# Altium project linkit-v4-hw.PrjPcb (part 2 of 2)

## Sheet interface.SchDoc
size A4; Organization: Arribada Initiative; Address1: https://github.com/arribada; Address2: contact@arribada.org; Address3: arribada.org; Address4: UK - Portsmouth; DocumentNumber: 10; SheetNumber: 10; SheetTotal: 13
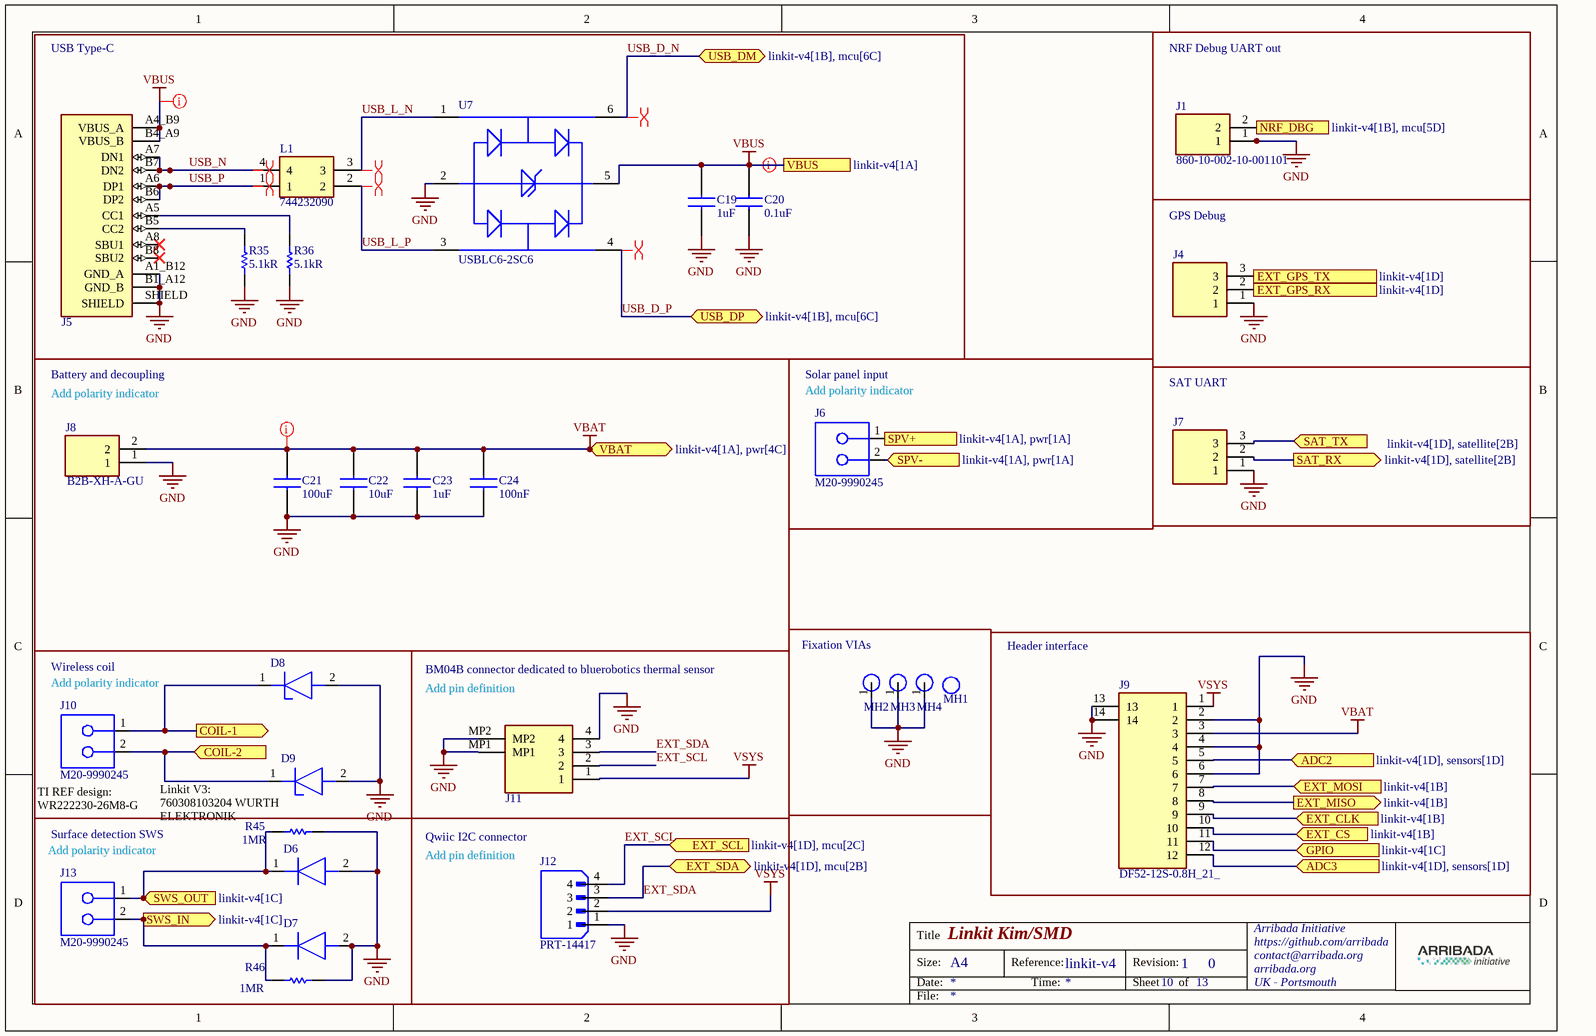
[diagram p4: interface.SchDoc]

### Parts
C19  1uF  [CAPC0603X35N]
C20  value 0.1uF  [CAPC0603X33N]  (hidden comment: 100nF)
C21  value 100uF  [CAPC3216X180N]  (hidden comment: GRM31CR61A107MEA8L)
C22  value 10uF  [CAPC1005X55N]  (hidden comment: GRM155R61A106ME11D)
C23  value 1uF  [CAPC1005X55N]  (hidden comment: GRM155R61E105KE11D)
C24  value 100nF  [0402]  (hidden comment: GRM155R71C104KA88D)
D6  ESD9L5.0ST5GH  [SODFL1006X40N]  (value not drawn)
D7  ESD9L5.0ST5GH  [SODFL1006X40N]  (value not drawn)
D8  PESD12VS1UL,315  [PESD5V0S1BL315]  (value not drawn)
D9  PESD12VS1UL,315  [PESD5V0S1BL315]  (value not drawn)
J1  860-10-002-10-001101  [8601000210001101]
J4  BC020-03-A-0200-0300-L-G  [BC02003A02000300LG]  (value not drawn)
J5  USB4215-03-A_REVA  [GCT_USB4215-03-A_REVA]  (value not drawn)
J6  M20-9990245  [HDR 2POS 2.54MM THRU HOLE]
J7  BC020-03-A-0200-0300-L-G  [BC02003A02000300LG]  (value not drawn)
J8  B2B-XH-A-GU  [B2BXHAGU]
J9  DF52-12S-0.8H_21_  [DF5212S08H21]
J10  M20-9990245  [HDR 2POS 2.54MM THRU HOLE]
J11  BM04B-GHS-TBT_LF__SN__N_  [CONN_BM04B-GHS-TBT_JST]  (value not drawn)
J12  PRT-14417  [SPARKFUN_PRT-14417]
J13  M20-9990245  [HDR 2POS 2.54MM THRU HOLE]
L1  744232090  [WE-CNSW-SMD]
MH1  Mounting Hole M2  [MOUNTING HOLE M2 UNPLATED]  (value not drawn)
MH2  Mounting Hole M2 Plated  [Mounting Hole M2 Plated]  (value not drawn)
MH3  Mounting Hole M2 Plated  [Mounting Hole M2 Plated]  (value not drawn)
MH4  Mounting Hole M2 Plated  [Mounting Hole M2 Plated]  (value not drawn)
R35  value 5.1kR  [RESC0603X28N]  (hidden comment: CRCW02015K10JNED)
R36  value 5.1kR  [RESC0603X28N]  (hidden comment: CRCW02015K10JNED)
R45  value 1MR  [RESC0603X26N]  (hidden comment: RC0201FR-7D1ML)
R46  value 1MR  [RESC0603X26N]  (hidden comment: RC0201FR-7D1ML)
U7  USBLC6-2SC6  [SOT95P280X145-6N]

### Blocks framed on the sheet
NRF Debug UART out: J1
USB Type-C: C19 C20 J5 L1 R35 R36 U7
GPS Debug: J4
SAT UART: J7
Fixation VIAs: MH1-MH4
Header interface: J9

### Ports
ADC2 (in, see linkit-v4[1D], sensors[1D]), ADC3 (in, see linkit-v4[1D], sensors[1D]), COIL-1 (out, see linkit-v4[1A], BQ51003YFPT_WirelessCharger_2.5W[1B], pwr[1C]), COIL-2 (in, see linkit-v4[1A], BQ51003YFPT_WirelessCharger_2.5W[1C], pwr[1C]), EXT_CLK (in, see linkit-v4[1B]), EXT_CS (in, see linkit-v4[1B]), EXT_GPS_RX (in, see linkit-v4[1D]), EXT_GPS_TX (in, see linkit-v4[1D]), EXT_MISO (out, see linkit-v4[1B]), EXT_MOSI (in, see linkit-v4[1B]), EXT_SCL (in, see linkit-v4[1D], mcu[2C]), EXT_SDA (bidir, see linkit-v4[1D], mcu[2B]), GPIO (in, see linkit-v4[1C]), NRF_DBG (in, see linkit-v4[1B], mcu[5D]), SAT_RX (out, see linkit-v4[1D], satellite[2B]), SAT_TX (in, see linkit-v4[1D], satellite[2B]), SPV+ (out, see linkit-v4[1A], pwr[1A]), SPV- (in, see linkit-v4[1A], pwr[1A]), SWS_IN (out, see linkit-v4[1C]), SWS_OUT (in, see linkit-v4[1C]), USB_DM (bidir, see linkit-v4[1B], mcu[6C]), USB_DP (bidir, see linkit-v4[1B], mcu[6C]), VBAT (bidir, see linkit-v4[1A], pwr[4C]), VBUS (see linkit-v4[1A])

### Nets
GND: C19.1 C20.1 C21.1 C22.2 C23.2 C24.2 D6.2(A) D7.2(A) D8.2(A) D9.2(A) J1.1 J4.1 J5.A1_B12(GND_A) J5.B1_A12(GND_B) J5.SHIELD J7.1 J8.1 J9.2 J9.4 J9.6 J9.13 J9.14 J11.4 J11.MP1 J11.MP2 J12.1 MH2.1 MH3.1 MH4.1 R35.1 R36.1 R45.2 R46.2 U7.2(GND)
VBAT: C21.2 C22.1 C23.1 C24.1 J8.2 J9.3 ; port VBAT
VBUS: C19.2 C20.2 J5.A4_B9(VBUS_A) J5.B4_A9(VBUS_B) U7.5(VBUS) ; port VBUS
VSYS: J9.1 J11.1 J12.2
ADC2: J9.5 ; port ADC2
ADC3: J9.12 ; port ADC3
COIL-1: D8.1(K) J10.1 ; port COIL-1
COIL-2: D9.1(K) J10.2 ; port COIL-2
EXT_CLK: J9.9 ; port EXT_CLK
EXT_CS: J9.10 ; port EXT_CS
EXT_GPS_RX: J4.2 ; port EXT_GPS_RX
EXT_GPS_TX: J4.3 ; port EXT_GPS_TX
EXT_MISO: J9.8 ; port EXT_MISO
EXT_MOSI: J9.7 ; port EXT_MOSI
EXT_SCL: J11.2 J12.4 ; port EXT_SCL
EXT_SDA: J11.3 J12.3 ; port EXT_SDA
GPIO: J9.11 ; port GPIO
NRF_DBG: J1.2 ; port NRF_DBG
SAT_RX: J7.2 ; port SAT_RX
SAT_TX: J7.3 ; port SAT_TX
SPV+: J6.1 ; port SPV+
SPV-: J6.2 ; port SPV-
SWS_IN: D7.1(K) J13.2 R46.1 ; port SWS_IN
SWS_OUT: D6.1(K) J13.1 R45.1 ; port SWS_OUT
USB_D_N: U7.6(I/O1_2) ; port USB_DM
USB_D_P: U7.4(I/O2_2) ; port USB_DP
USB_L_N: L1.3 U7.1(I/O1_1)
USB_L_P: L1.2 U7.3(I/O2_1)
USB_N: J5.A7(DN1) J5.B7(DN2) L1.4
USB_P: J5.A6(DP1) J5.B6(DP2) L1.1
NetJ5_A5: J5.A5(CC1) R36.2
NetJ5_B5: J5.B5(CC2) R35.2

Not connected (* = marked no-connect by the designer): J5 A8(SBU1)* B8(SBU2)*

### Layout directives
differential pair; rule Impedance Constraint [Min = 80.00    Max = 100.0    ]; differential pair class USB: USB_D_N, USB_D_P, USB_L_N, USB_L_P, USB_N, USB_P
net class Power; rule Width Constraint [Pref Width = 0.4mm    Min Width = 0.2mm    Max Width = 0.8mm]; rule Width Constraint [Pref Width = 0.4mm    Min Width = 0.2mm    Max Width = 0.8mm]; rule Width Constraint [Pref Width = 0.4mm    Min Width = 0.2mm    Max Width = 0.8mm]; rule Width Constraint [Pref Width = 0.4mm    Min Width = 0.2mm    Max Width = 0.8mm]: VBAT, VBUS

### Notes on the sheet
- Battery and decoupling
- Solar panel input
- (near J8) Add polarity indicator
- (near J6) Add polarity indicator
- (near J10) Add polarity indicator
- Wireless coil
- BM04B connector dedicated to bluerobotics thermal sensor
- (near J11) Add pin definition
- (near J10) TI REF design:
  WR222230-26M8-G
- (near J13) Add polarity indicator
- Surface detection SWS
- Linkit V3:
  760308103204 WURTH ELEKTRONIK
- Qwiic I2C connector
- Add pin definition
- Title
- Size:
- Date:
- A4
- Reference:
- Time:
- Revision:
- Sheet
- of
- File:

### Library data of the parts
C19 = CL03A105KP3NSNC: Multilayer Ceramic Capacitors MLCC - SMD/SMT 1uF+/-10% 10V X5R 06 0201; Manufacturer_Name: SAMSUNG; Geometry.Height: 0.35mm; Mouser Part Number: 187-CL03A105KP3NSNC; Mouser Price/Stock: https://www.mouser.co.uk/ProductDetail/Samsung-Electro-Mechanics/CL03A105KP3NSNC?qs=47mY1nHWefQ3GOjXGTFrfg%3D%3D; Manufacturer_Part_Number: CL03A105KP3NSNC; Datasheet Link: https://datasheet.datasheetarchive.com/originals/distributors/DKDS-19/372696.pdf; Value: 1uF
C20 = GRM033Z71C104KE14D: Multilayer Ceramic Capacitors MLCC - SMD/SMT .1UF     16V   10%        0201; Manufacturer_Name: Murata Electronics; Manufacturer 1: Murata; Geometry.Height: 0.33mm; Description 1: Cap Ceramic 0.1uF 16V X7R 10% Pad SMD 0201 125C T/R; Mouser Part Number: 81-GRM033Z71C104KE4D; Mouser Price/Stock: https://www.mouser.co.uk/ProductDetail/Murata-Electronics/GRM033Z71C104KE14D?qs=lEfY3O89AqkdMqrSfAAk2w%3D%3D; Manufacturer_Part_Number: GRM033Z71C104KE14D; Datasheet Link: http://www.murata.com/~/media/webrenewal/support/library/catalog/products/capacitor/mlcc/c02e.pdf; Supplier 1: Mouser; Supplier Part Number 1: 81-GRM033Z71C104KE4D; Manufacturer Part Number 1: GRM033Z71C104KE14D; RoHS 1: Yes; Category 1: Ceramic Capacitors; Stock 1: 739403; Pricing 1: 1=0,1, 10=0,017, 50=0,017, 100=0,01, 1000=0,008, 10000=0,006 (USD); Case/Package: 0201; RoHS Compliant: Yes
C21 = GRM31CR61A107MEA8L: Multilayer Ceramic Capacitors MLCC - SMD/SMT 100 uF 10 VDC 20% 1206 X5R; Manufacturer_Name: Murata Electronics; Datasheet Link: http://www.murata.com/~/media/webrenewal/support/library/catalog/products/capacitor/mlcc/c02e.pdf; Height: 1.8mm; Manufacturer_Part_Number: GRM31CR61A107MEA8L; Mouser Part Number: 81-GRM31CR61A107MA8L; Mouser Price/Stock: https://www.mouser.co.uk/ProductDetail/Murata-Electronics/GRM31CR61A107MEA8L?qs=hd1VzrDQEGidurXiDTJOCg%3D%3D; Arrow Part Number: GRM31CR61A107MEA8L; Arrow Price/Stock: https://www.arrow.com/en/products/grm31cr61a107mea8l/murata-manufacturing?region=nac
C22 = GRM155R61A106ME11D: Multilayer Ceramic Capacitors MLCC - SMD/SMT 10 uF 10 VDC 20% 0402 X5R; Manufacturer_Name: Murata Electronics; Datasheet Link: http://www.murata.com/~/media/webrenewal/support/library/catalog/products/capacitor/mlcc/c02e.pdf; Height: 0.55mm; Manufacturer_Part_Number: GRM155R61A106ME11D; Mouser Part Number: 81-GRM155R61A106ME1D; Mouser Price/Stock: https://www.mouser.co.uk/ProductDetail/Murata-Electronics/GRM155R61A106ME11D?qs=xZ%2FP%252Ba9zWqZMJSi57Q8OyA%3D%3D; Arrow Part Number: GRM155R61A106ME11D; Arrow Price/Stock: https://www.arrow.com/en/products/grm155r61a106me11d/murata-manufacturing?region=nac
C23 = GRM155R61E105KE11D: Multilayer Ceramic Capacitors MLCC - SMD/SMT 1 uF 25 VDC 10% 0402 X5R; Manufacturer_Name: Murata Electronics; Datasheet Link: http://www.murata.com/~/media/webrenewal/support/library/catalog/products/capacitor/mlcc/c02e.pdf; Height: 0.55mm; Manufacturer_Part_Number: GRM155R61E105KE11D; Mouser Part Number: 81-GRM155R61E105KE1D; Mouser Price/Stock: https://www.mouser.co.uk/ProductDetail/Murata-Electronics/GRM155R61E105KE11D?qs=QzBtWTOodeUQ00WJlpqFiw%3D%3D; Arrow Part Number: GRM155R61E105KE11D; Arrow Price/Stock: https://www.arrow.com/en/products/grm155r61e105ke11d/murata-manufacturing?region=nac
C24 = GRM155R71C104KA88D: Multilayer Ceramic Capacitors MLCC - SMD/SMT 0.1 uF 16 VDC 10% 0402 X7R; Manufacturer_Part_Number: CC0402KRX7R7BB104; Manufacturer: YAGEO; Manufacturer 1: Murata; Description 1: 0402 0.1 uF 16V ±10 % Tolerance X7R SMT Multilayer Ceramic Capacitor; Voltage Rating: 16V; Package: C0402; Supplier 1: Mouser; Supplier Part Number 1: 81-GRM155R71C104KA88; Manufacturer Part Number 1: GRM155R71C104KA88D; RoHS 1: Yes; Category 1: Ceramic Capacitors; Stock 1: 7816691; Pricing 1: 1=0,1, 10=0,017, 50=0,017, 100=0,01, 1000=0,008, 10000=0,005 (USD); Mount: Surface Mount; Case/Package: 0402; Number of Pins: 2; Case Code (Metric): 1005; Case Code (Imperial): 0402; Material: Ceramic; Dielectric Material: Ceramic; Min Operating Temperature: -55°C; Max Operating Temperature: 125°C; Capacitance: 100nF; Tolerance: 10%; Packaging: Tape and Reel; Voltage Rating (DC): 16V; Package Quantity: 1; Dielectric: X7R; Termination: SMD/SMT; Voltage: 16V; Series: GRM; Length: 1mm; Width: 0.02inch; Height: 0.5mm; Thickness: 0.022inch; Depth: 0.5mm; Radiation Hardening: No; Lead Free: Lead Free; RoHS Compliant: Yes; Reach SVHC Compliant: Unknown; ComponentLink1URL: https://datasheet.ciiva.com/129/grm155r71c104ka88-01-129739.pdf?src-supplier=Digi-Key; ComponentLink1Description: https://datasheet.ciiva.com/129/grm155r71c104ka88-01-129739.pdf?src-supplier=Digi-Key; ComponentLink2URL: https://datasheet.ciiva.com/129/grm155r71c104ka88-01-129740.pdf?src-supplier=Digi-Key; ComponentLink2Description: https://datasheet.ciiva.com/129/grm155r71c104ka88-01-129740.pdf?src-supplier=Digi-Key; ComponentLink3URL: https://datasheet.ciiva.com/29199/454098-da-01-en-vs-kondensator-0402-29199799.pdf?src-supplier=Conrad; ComponentLink3Description: https://datasheet.ciiva.com/29199/454098-da-01-en-vs-kondensator-0402-29199799.pdf?src-supplier=Conrad; ComponentLink4URL: https://datasheet.ciiva.com/7937/4360-7937615.pdf?src-supplier=Element14; ComponentLink4Description: https://datasheet.ciiva.com/7937/4360-7937615.pdf?src-supplier=Element14; ComponentLink5URL: https://datasheet.ciiva.com/14116/grmseries-highdielectrictype-eng-14116878.pdf?src-supplier=Distrelec; ComponentLink5Description: https://datasheet.ciiva.com/14116/grmseries-highdielectrictype-eng-14116878.pdf?src-supplier=Distrelec; ComponentLink6URL: https://datasheet.ciiva.com/14103/grmseries-highdielectrictype-eng-14103750.pdf?src-supplier=Distrelec; ComponentLink6Description: https://datasheet.ciiva.com/14103/grmseries-highdielectrictype-eng-14103750.pdf?src-supplier=Distrelec; ComponentLink7URL: https://datasheet.ciiva.com/28534/4360-28534127.pdf?src-supplier=Element14; ComponentLink7Description: https://datasheet.ciiva.com/28534/4360-28534127.pdf?src-supplier=Element14; ComponentLink8URL: https://datasheet.ciiva.com/28534/4360-28534133.pdf?src-supplier=Element14; ComponentLink8Description: https://datasheet.ciiva.com/28534/4360-28534133.pdf?src-supplier=Element14
D6 D7 = ESD9L5.0ST5GH: Diode; Manufacturer_Name: onsemi; Datasheet Link: https://www.onsemi.com/pdf/datasheet/esd9l-d.pdf; Height: 0.4mm; Manufacturer_Part_Number: ESD9L5.0ST5GH
D8 D9 = PESD12VS1UL,315: Diode ESD (Uni-directional); Manufacturer_Name: Nexperia; Datasheet Link: https://assets.nexperia.com/documents/data-sheet/PESD12VS1UL.pdf; Height: 0mm; Manufacturer_Part_Number: PESD12VS1UL,315; Mouser Part Number: 771-PESD12VS1UL315; Mouser Price/Stock: https://www.mouser.co.uk/ProductDetail/Nexperia/PESD12VS1UL315?qs=LOCUfHb8d9vNAqHjzC5o%2FA%3D%3D; Arrow Part Number: PESD12VS1UL,315; Arrow Price/Stock: https://www.arrow.com/en/products/pesd12vs1ul315/nexperia?utm_currency=USD&region=nac
J1 = 860-10-002-10-001101: Connector, Header 2 pos, 1 row, pitch 1mm; Manufacturer_Name: Preci-Dip; Datasheet Link: https://www.precidip.com/AppHost/9696,1/Scripts/Modules/Catalog/Default.aspx?c=8&i=516&p=101&pdf=1&dsku=860-10-NNN-10-001101; Height: 3.63mm; Manufacturer_Part_Number: 860-10-002-10-001101; Mouser Part Number: 437-8601000210001101; Mouser Price/Stock: https://www.mouser.co.uk/ProductDetail/Preci-dip/860-10-002-10-001101?qs=jrVTBkKbt4YuZ%2FSZyJlz1w%3D%3D
J4 J7 = BC020-03-A-0200-0300-L-G: Connector; Manufacturer_Name: GCT (GLOBAL CONNECTOR TECHNOLOGY); Datasheet Link: https://www.mouser.com/datasheet/2/837/BC020-1948594.pdf; Height: 3.2mm; Manufacturer_Part_Number: BC020-03-A-0200-0300-L-G
J5 = USB4215-03-A_REVA: USB Connectors USB C Receptacle, Short Body, USB2.0, 16Pin, Horizontal, SMT; MF: Global Connector Technology; SnapEDA_Link: https://www.snapeda.com/parts/USB4215-03-A/Global+Connector+Technology/view-part/?ref=snap; Package: None; Value: *; MP: USB4215-03-A; Check_prices: https://www.snapeda.com/parts/USB4215-03-A/Global+Connector+Technology/view-part/?ref=eda
J6 J10 J13 = M20-9990245: CON HDR 2POS HEADER 2.54MM VERT THRU HOLE; Manufacturer: Harwin; Manufacturers Part Number: M20-9990245; Supplier 1: Digi-Key; Supplier 2: Mouser; Supplier Part Number 1: 952-2261-ND; Supplier Part Number 2: 855-M20-9990245; Distributor 1: EBV; Distributor 2: Future Electronics
J8 = B2B-XH-A-GU: Connector; Manufacturer_Name: JST (JAPAN SOLDERLESS TERMINALS); Datasheet Link: http://www.jst-mfg.com/product/pdf/eng/eXH.pdf; Height: 7mm; Manufacturer_Part_Number: B2B-XH-A-GU; Mouser Part Number: N/A; Mouser Price/Stock: https://www.mouser.co.uk/ProductDetail/JST-Commercial/B2B-XH-A-GU?qs=IKkN%2F947nfBVsqimfO%252BieQ%3D%3D; Arrow Part Number: B2B-XH-A-GU; Arrow Price/Stock: https://www.arrow.com/en/products/b2b-xh-a-gu/jst-manufacturing?utm_currency=USD&region=europe
J9 = DF52-12S-0.8H_21_: Headers & Wire Housings Recep 12P R/A 0.8mm Pitch; Manufacturer_Name: Hirose; Manufacturer_Part_Number: DF52-12S-0.8H(21); Datasheet Link: https://www.hirose.com/product/en/products/DF52/DF52-12S-0.8H%2821%29/; Height: 1mm; Mouser Part Number: 798-DF52-12S-0.8H21; Mouser Price/Stock: https://www.mouser.co.uk/ProductDetail/Hirose-Connector/DF52-12S-0.8H21?qs=%2FKR40Cd6GUo160JXe3226w%3D%3D
J11 = BM04B-GHS-TBT_LF__SN__N_: Headers & Wire Housings GH HEADER (SMT/TOP TYPE); Manufacturer_Name: JST (JAPAN SOLDERLESS TERMINALS); Manufacturer_Part_Number: BM04B-GHS-TBT(LF)(SN)(N); Datasheet Link: http://www.jst-mfg.com/product/pdf/eng/eGH.pdf; Height: 4.05mm; Mouser Part Number: N/A; Mouser Price/Stock: https://www.mouser.co.uk/ProductDetail/JST-Commercial/BM04B-GHS-TBTLFSNN?qs=QpmGXVUTftGHKxacCgPJ1g%3D%3D; Arrow Part Number: BM04B-GHS-TBT(LF)(SN)(N); Arrow Price/Stock: https://www.arrow.com/en/products/bm04b-ghs-tbt-lf-sn-n/jst-manufacturing?region=europe
J12 = PRT-14417: QWIIC JST CONNECTOR - SMD 4-PIN; MF: SparkFun Electronics; SnapEDA_Link: https://www.snapeda.com/parts/PRT-14417/SparkFun+Electronics/view-part/?ref=snap; Package: None; Value: *; MP: PRT-14417; Check_prices: https://www.snapeda.com/parts/PRT-14417/SparkFun+Electronics/view-part/?ref=eda
L1 = 744232090: Common Mode Chokes / Filters WE-CNSW 1206 370mA 90Ohm 100MHz AECQ200; Manufacturer_Name: Wurth Elektronik; Datasheet Link: https://datasheet.datasheetarchive.com/originals/distributors/Datasheets_SAMA/c4bd373adc4470b1464be5d10e6e206e.pdf; Manufacturer_Part_Number: 744232090; Mouser Part Number: 710-744232090; Mouser Price/Stock: https://www.mouser.co.uk/ProductDetail/Wurth-Elektronik/744232090?qs=PGXP4M47uW6L5fAiLO6yTw%3D%3D
MH1 = Mounting Hole M2: Manufacturer: NOT FITTED PART; Manufacturers Part Number: NOT FITTED PART; Distributor 1: EBV; Distributor 2: Future Electronics
MH2-MH4 = Mounting Hole M2 Plated: Manufacturer: NOT FITTED PART; Manufacturers Part Number: NOT FITTED PART; Distributor 1: EBV; Distributor 2: Future Electronics
R35 R36 = CRCW02015K10JNED: Thick Film Resistors - SMD 1/20watt 5.1Kohms 5% 200ppm; Manufacturer_Name: Vishay; Datasheet Link: http://www.vishay.com/docs/20035/dcrcwe3.pdf; Height: 0.28mm; Manufacturer_Part_Number: CRCW02015K10JNED; Mouser Part Number: 71-CRCW02015K10JNED; Mouser Price/Stock: https://www.mouser.com/Search/Refine.aspx?Keyword=71-CRCW02015K10JNED
R45 R46 = RC0201FR-7D1ML: Thick Film Resistors - SMD 1 MOhms 50 mW 0201 1%; Manufacturer_Name: KEMET; Datasheet Link: http://www.yageo.com/documents/recent/PYu-RC0201_51_RoHS_L_8.pdf; Height: 0.26mm; Manufacturer_Part_Number: RC0201FR-7D1ML; Mouser Part Number: 603-RC0201FR-7D1ML; Mouser Price/Stock: https://www.mouser.co.uk/ProductDetail/YAGEO/RC0201FR-7D1ML?qs=NgbZBzc1CyEo5FlGf5N0Ug%3D%3D; Arrow Part Number: RC0201FR-7D1ML; Arrow Price/Stock: https://www.arrow.com/en/products/rc0201fr-7d1ml/yageo
U7 = USBLC6-2SC6: ESD Suppressors / TVS Diodes High Speed Interface Protection Low Cap; Manufacturer_Name: STMicroelectronics; Datasheet Link: http://www.st.com/st-web-ui/static/active/en/resource/technical/document/datasheet/CD00050750.pdf; Height: 1.45mm; Manufacturer_Part_Number: USBLC6-2SC6; Mouser Part Number: 511-USBLC6-2SC6; Mouser Price/Stock: https://www.mouser.co.uk/ProductDetail/STMicroelectronics/USBLC6-2SC6?qs=po45yt2pPpu%2FhNIlwQdTlg%3D%3D; Arrow Part Number: USBLC6-2SC6; Arrow Price/Stock: https://www.arrow.com/en/products/usblc6-2sc6/stmicroelectronics?utm_currency=USD&region=europe

## Sheet pwr.SchDoc
size A4; Organization: Arribada Initiative; Address1: https://github.com/arribada; Address2: contact@arribada.org; Address3: arribada.org; Address4: UK - Portsmouth; DocumentNumber: 3; SheetNumber: 3; SheetTotal: 13
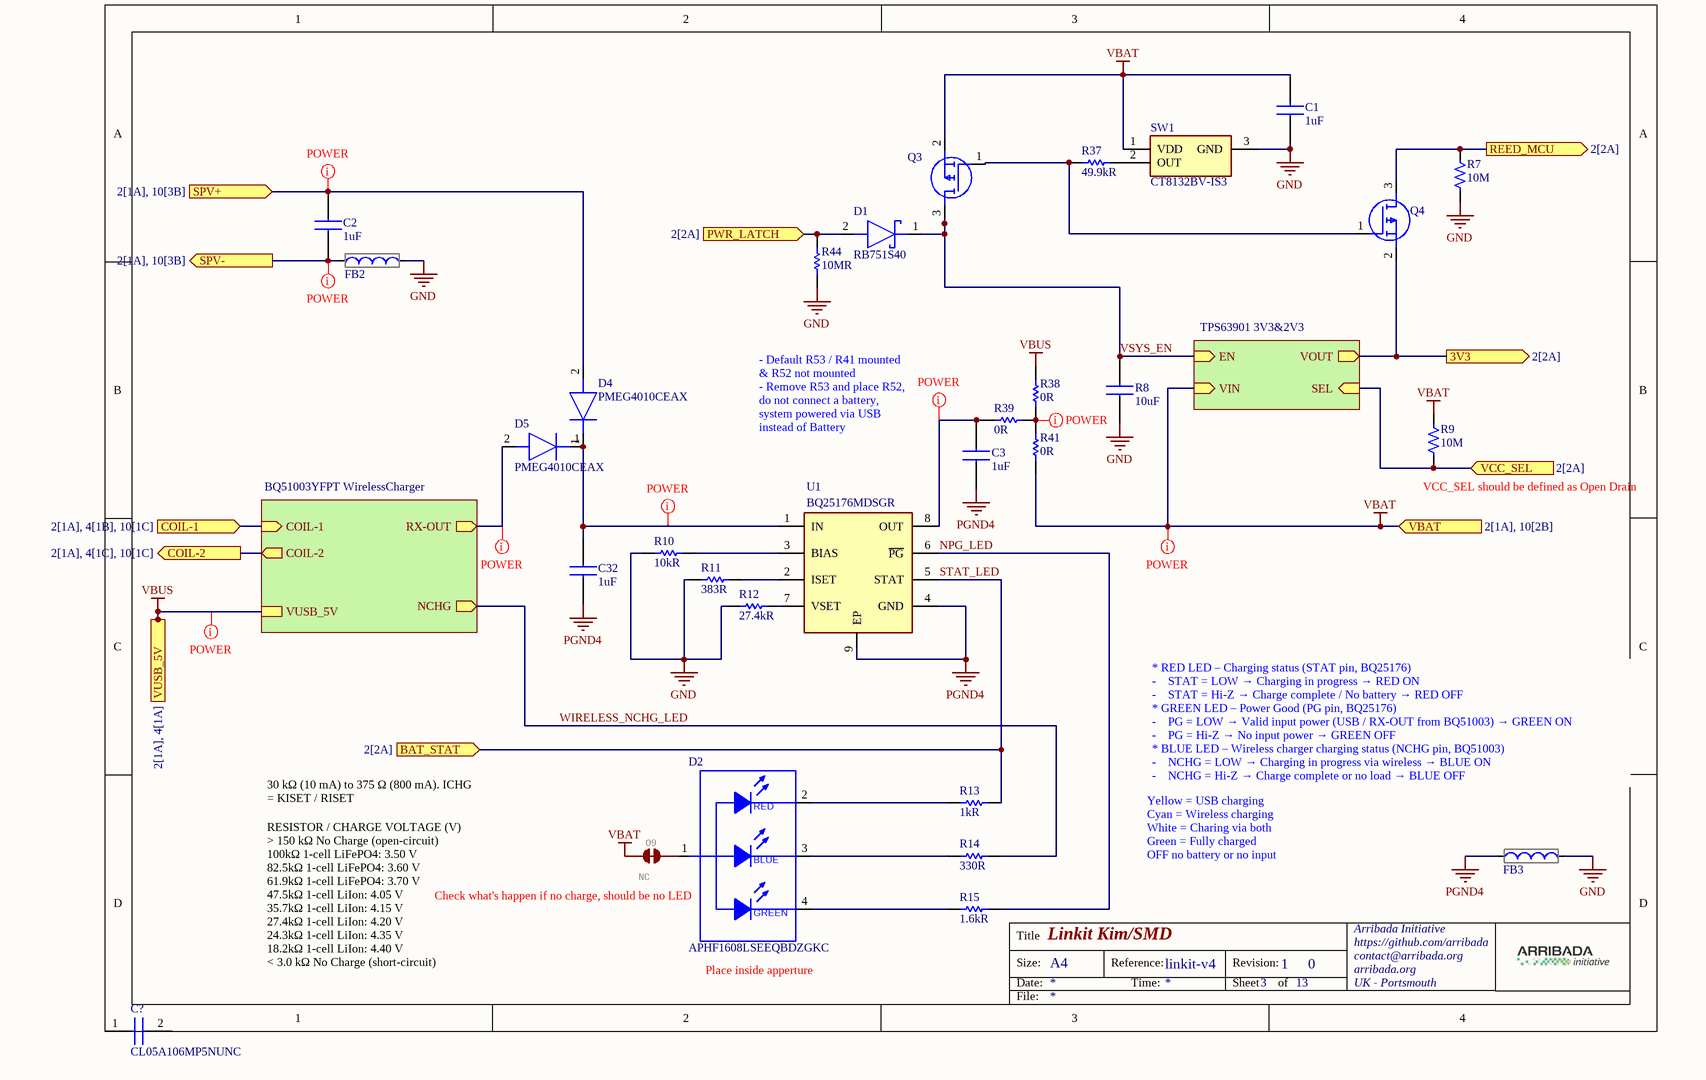
[diagram p5: pwr.SchDoc]

### Parts
C1  value 1uF  [CAPC1005X55N]  (hidden comment: GRM155R61E105KE11D)
C2  value 1uF  [GRM15x]  (hidden comment: GRM155R61H105ME05J)
C3  value 1uF  [CAPC1608X90N]  (hidden comment: GCM188R71C105KA64D)
C32  value 1uF  [GRM15x]  (hidden comment: GRM155R61H105ME05J)
C?  CL05A106MP5NUNC  [CAPC1005X55N]
D1  RB751S40  [SODFL1608X65N]
D2  APHF1608LSEEQBDZGKC  [LED RGB 0603]
D4  PMEG4010CEAX  [SOD2512X110N]
D5  PMEG4010CEAX  [SOD2512X110N]
FB2  BLM18AG102SN1D  [BLM18SP221SN1B]  (value not drawn)
FB3  BLM18AG102SN1D  [BLM18SP221SN1B]  (value not drawn)
O9  NC  [SMT-JUMPER_2_NC_TRACE_SILK]  (net tie, no BOM)
Q3  IRLML6401TRPBF  [SOT95P237X112-3N]  (value not drawn)
Q4  IRLML6401TRPBF  [SOT95P237X112-3N]  (value not drawn)
R7  value 10M  [RES0402L]  (hidden comment: 10M 0402 1%)
R8  value 10uF  [CAPC1005X55N]  (hidden comment: CL05A106MP5NUNC)
R9  value 10M  [RES0402L]  (hidden comment: 10M 0402 1%)
R10  value 10kR  [ERJS02_U02_(0402)]  (hidden comment: ERJ-U02F1002X)
R11  value 383R  [RESC0603X28N]  (hidden comment: CRCW0201383RFNED)
R12  value 27.4kR  [RESC0603X28N]  (hidden comment: CRCW020127K4FNED)
R13  value 1kR  [RESC1005X40N]  (hidden comment: RC0402JR-7D1KL)
R14  value 330R  [RESC1005X40N]  (hidden comment: RC0402JR-7D330RL)
R15  value 1.6kR  [RESC1005X40N]  (hidden comment: CRCW04021K60JNED)
R37  value 49.9kR  [RESC1005X40N]  (hidden comment: CRCW040249K9FKED)
R38  value 0R  [RESC1005X40N]  (hidden comment: CRCW04020000Z0EEHP)
R39  value 0R  [RESC1005X40N]  (hidden comment: CRCW04020000Z0EEHP)
R41  value 0R  [RESC1005X40N]  (hidden comment: CRCW04020000Z0EEHP)
R44  value 10MR  [RESC0603X26N]  (hidden comment: RC0201FR-0710ML)
SW1  CT8132BV-IS3  [SOT95P280X140-3N]
U1  BQ25176MDSGR  [SON50P200X200X80-9N]

### Sub-sheets
BQ51003YFPT WirelessCharger = BQ51003YFPT_WirelessCharger_2.5W (file not in this document): COIL-2 (out), COIL-1 (in), RX-OUT (out), VUSB_5V, NCHG (out)
TPS63901 3V3&2V3 = TPS63901_BuckBoost_lowIq_3V3&2V3_400mA (file not in this document): VIN (in), VOUT (out), EN (in), SEL (in)

### Ports
3V3 (out, see 2[2A]), BAT_STAT (in, see 2[2A]), COIL-1 (in, see 2[1A], 4[1B], 10[1C]), COIL-2 (out, see 2[1A], 4[1C], 10[1C]), PWR_LATCH (in, see 2[2A]), REED_MCU (out, see 2[2A]), SPV+ (in, see 2[1A], 10[3B]), SPV- (out, see 2[1A], 10[3B]), VBAT (in, see 2[1A], 10[2B]), VCC_SEL (in, see 2[2A]), VUSB_5V (see 2[1A], 4[1A])

### Nets
GND: C1.2 FB2.2 FB3.2 R7.1 R8.1 R10.1 R11.1 R12.1 R44.1 SW1.3(GND)
PGND4: C3.1 C32.2 FB3.1 U1.4(GND) U1.9(EP)
VBAT: C1.1 O9.1 Q3.2(S) R9.2 R41.2 SW1.1(VDD) ; port VBAT, sheet TPS63901 3V3&2V3/VIN
VBUS: R38.2 ; port VUSB_5V, sheet BQ51003YFPT WirelessCharger/VUSB_5V
3V3: Q4.2(S) ; port 3V3, sheet TPS63901 3V3&2V3/VOUT
COIL-1: port COIL-1, sheet BQ51003YFPT WirelessCharger/COIL-1
COIL-2: port COIL-2, sheet BQ51003YFPT WirelessCharger/COIL-2
NPG_LED: R15.2 U1.6(~{PG})
PWR_LATCH: D1.2(A) R44.2 ; port PWR_LATCH
REED_MCU: Q4.3(D) R7.2 ; port REED_MCU
SPV+: C2.1 D4.2(A) ; port SPV+
SPV-: C2.2 FB2.1 ; port SPV-
STAT_LED: R13.2 U1.5(STAT) ; port BAT_STAT
VCC_SEL: R9.1 ; port VCC_SEL, sheet TPS63901 3V3&2V3/SEL
VSYS_EN: D1.1(K) Q3.3(D) R8.2 ; sheet TPS63901 3V3&2V3/EN
WIRELESS_NCHG_LED: R14.1 ; sheet BQ51003YFPT WirelessCharger/NCHG
NetC3_2: C3.2 R39.1 U1.8(OUT)
NetC32_1: C32.1 D4.1(K) D5.1(K) U1.1(IN)
NetD2_1: D2.1 O9.2
NetD2_2: D2.2 R13.1
NetD2_3: D2.3 R14.2
NetD2_4: D2.4 R15.1
NetD5_2: D5.2(A) ; sheet BQ51003YFPT WirelessCharger/RX-OUT
NetQ3_1: Q3.1(G) Q4.1(G) R37.1
NetR10_2: R10.2 U1.3(BIAS)
NetR11_2: R11.2 U1.2(ISET)
NetR12_2: R12.2 U1.7(VSET)
NetR37_2: R37.2 SW1.2(OUT)
NetR38_1: R38.1 R39.2 R41.1

Not connected (* = marked no-connect by the designer): C? 1 2

### Layout directives
net class POWER; rule Width Constraint [Pref Width = 0.5mm    Min Width = 0.4mm    Max Width = 1mm]: NetC3_2, NetC32_1, NetD5_2, NetR38_1, SPV+, SPV-, VBAT, VBUS

### Notes on the sheet
- - Default R53 / R41 mounted & R52 not mounted
  - Remove R53 and place R52, do not connect a battery, system powered via USB instead of Battery
- (near R9) VCC_SEL should be defined as Open Drain
- * RED LED – Charging status (STAT pin, BQ25176)
  -    STAT = LOW → Charging in progress → RED ON
  -    STAT = Hi-Z → Charge complete / No battery → RED OFF
  * GREEN LED – Power Good (PG pin, BQ25176)
  -    PG = LOW → Valid input power (USB / RX-OUT from BQ51003) → GREEN ON
  -    PG = Hi-Z → No input power → GREEN OFF
  * BLUE LED – Wireless charger charging status (NCHG pin, BQ51003)
  -    NCHG = LOW → Charging in progress via wireless → BLUE ON
  -    NCHG = Hi-Z → Charge complete or no load → BLUE OFF
- 30 kΩ (10 mA) to 375 Ω (800 mA). ICHG = KISET / RISET
- (near D2) Check what's happen if no charge, should be no LED
- Yellow = USB charging
  Cyan = Wireless charging
  White = Charing via both
  Green = Fully charged
  OFF no battery or no input
- RESISTOR / CHARGE VOLTAGE (V)
  > 150 kΩ No Charge (open-circuit)
  100kΩ 1-cell LiFePO4: 3.50 V
  82.5kΩ 1-cell LiFePO4: 3.60 V
  61.9kΩ 1-cell LiFePO4: 3.70 V
  47.5kΩ 1-cell LiIon: 4.05 V
  35.7kΩ 1-cell LiIon: 4.15 V
  27.4kΩ 1-cell LiIon: 4.20 V
  24.3kΩ 1-cell LiIon: 4.35 V
  18.2kΩ 1-cell LiIon: 4.40 V
  < 3.0 kΩ No Charge (short-circuit)
- Place inside apperture
- Title
- Size:
- Date:
- A4
- Reference:
- Time:
- Revision:
- Sheet
- of
- File:
- (in symbol LED RGB 0603 2MA) RED; BLUE; GREEN

### Library data of the parts
C1 = GRM155R61E105KE11D: as C23 on sheet interface; Datasheet Link: http://www.murata.com/~/media/webrenewal/support/library/catalog/products/capacitor/mlcc/c02e.pdf; Height: 0.55mm; Manufacturer_Part_Number: GRM155R61E105KE11D; Mouser Part Number: 81-GRM155R61E105KE1D; Mouser Price/Stock: https://www.mouser.co.uk/ProductDetail/Murata-Electronics/GRM155R61E105KE11D?qs=QzBtWTOodeUQ00WJlpqFiw%3D%3D; Arrow Part Number: GRM155R61E105KE11D; Arrow Price/Stock: https://www.arrow.com/en/products/grm155r61e105ke11d/murata-manufacturing?region=nac
C2 C32 = GRM155R61H105ME05J: Multilayer Ceramic Capacitors MLCC - SMD/SMT 1 uF 50 VDC 20% 0402 X5R; Manufacturer: Murata; Material: 4241ConductorMaterial; Voltage Rating: 50V; Dielectric: 1537DielectricType; Supplier: Mouser; Supplier Part Number: 81-GRM155R61H105ME5J; Manufacturer Part Number: GRM155R61H105ME05J; RoHS: Yes; Category: Ceramic Capacitors; Stock: 30797; Pricing: 1=0,1, 10=0,045, 50=0,045, 100=0,027, 1000=0,02, 10000=0,014 (USD); Case/Package: 343Case; Min Operating Temperature: -55°C; Max Operating Temperature: 85°C; Tolerance: 20%; Voltage Rating (DC): 50V; Length: 1mm; Width: 500um; Height: 600um; Thickness: 500um; RoHS Compliant: 5897YesNo
C3 = GCM188R71C105KA64D: Multilayer Ceramic Capacitors MLCC - SMD/SMT 1 uF 16 VDC 10% 0603 X7R AEC-Q200; Manufacturer_Name: Murata Electronics; Datasheet Link: https://search.murata.co.jp/Ceramy/image/img/A01X/G101/ENG/GCM188R71C105KA64-04A.pdf; Height: 0.9mm; Manufacturer_Part_Number: GCM188R71C105KA64D; Mouser Part Number: 81-GCM188R71C105K64D; Mouser Price/Stock: https://www.mouser.co.uk/ProductDetail/Murata-Electronics/GCM188R71C105KA64D?qs=bQrJpfqjX%252BKtVgLYIBGvIg%3D%3D; Arrow Part Number: GCM188R71C105KA64D; Arrow Price/Stock: https://www.arrow.com/en/products/gcm188r71c105ka64d/murata-manufacturing?region=nac
C? = CL05A106MP5NUNC: Capacitor; Manufacturer_Name: SAMSUNG; Datasheet Link: http://media.digikey.com/pdf/Data%20Sheets/Samsung%20PDFs/CL_Series_MLCC_ds.pdf; Height: 0.55mm; Manufacturer_Part_Number: CL05A106MP5NUNC; Mouser Part Number: 187-CL05A106MP5NUNC; Mouser Price/Stock: https://www.mouser.co.uk/ProductDetail/Samsung-Electro-Mechanics/CL05A106MP5NUNC?qs=X6jEic%2FHinA5hRYAnV6SHQ%3D%3D; Arrow Part Number: CL05A106MP5NUNC; Arrow Price/Stock: https://www.arrow.com/en/products/cl05a106mp5nunc/samsung-electro-mechanics?utm_currency=USD&region=europe
D1 = RB751S40: Schottky Diodes & Rectifiers 40V,Schottky,SOD-523,0.3A; Manufacturer_Name: Nexperia; Datasheet Link: https://4donline.ihs.com/images/VipMasterIC/IC/NEXP/NEXP-S-A0012401467/NEXP-S-A0012401473-1.pdf?hkey=EF798316E3902B6ED9A73243A3159BB0; Height: 0.65mm; Manufacturer_Part_Number: RB751S40; Mouser Part Number: N/A; Mouser Price/Stock: https://www.mouser.co.uk/ProductDetail/Nexperia/RB751S40?qs=vHuUswq2%252BsxYe2VJDNOssA%3D%3D
D2 = LED RGB 0603 2MA: Manufacturer: Kingbright; Manufacturers Part Number: APHF1608LSEEQBDZGKC; Supplier 1: Mouser; Supplier 2: Digi-Key; Supplier Part Number 1: 604-APHF1608LQBDZGKC; Supplier Part Number 2: 754-2143-1-ND; Distributor 1: EBV; Distributor 2: Future Electronics; Colour: RGB; Value: APHF1608LSEEQBDZGKC
D4 D5 = PMEG4010CEAX: Diode; Manufacturer_Name: Nexperia; Datasheet Link: https://mouser.componentsearchengine.com/Datasheets/1/PMEG4010CEAX.pdf; Height: 1.1mm; Manufacturer_Part_Number: PMEG4010CEAX; Mouser Part Number: 771-PMEG4010CEAX; Mouser Price/Stock: https://www.mouser.co.uk/ProductDetail/Nexperia/PMEG4010CEAX?qs=0C8XhJW8e4oZXiLPP2pzOA%3D%3D; Arrow Part Number: PMEG4010CEAX; Arrow Price/Stock: https://www.arrow.com/en/products/pmeg4010ceax/nexperia
FB2 FB3 = BLM18AG102SN1D: Ferrite Bead - 1000 OHM 25%; Manufacturer_Name: Murata Electronics; Datasheet Link: http://www.murata.com/~/media/webrenewal/support/library/catalog/products/emc/emifil/c31e.ashx?la=en-gb; Height: 0.95mm; Manufacturer_Part_Number: BLM18AG102SN1D; Mouser Part Number: 81-BLM11A102S; Mouser Price/Stock: https://www.mouser.co.uk/ProductDetail/Murata-Electronics/BLM18AG102SN1D?qs=b2kFoOhrN4V4XjRBmusv4w%3D%3D; Arrow Part Number: BLM18AG102SN1D; Arrow Price/Stock: https://www.arrow.com/en/products/blm18ag102sn1d/murata-manufacturing?utm_currency=USD&region=nac
O9 = JUMPER-SMT_2_NC_TRACE_SILK: Normally closed trace jumper    This jumper has a trace between two pads so it's normally closed (NC). Use a razor knife to open the connection. For best results follow the IPC guidelines for cutting traces: Cutout at least 0.063 mm (0.005 in).  Remove all loose material to clean up the cut area.  Seal the cut with an approved epoxy.       Reapply solder to reclose the connection.; GateName_1: G$1; SymbolName_1: SMT-JUMPER_2_NC_TRACE; DeviceName: _SILK; LibraryName: SparkFun-Jumpers; DeviceSetName: JUMPER-SMT_2_NC_TRACE
Q3 Q4 = IRLML6401TRPBF: MOSFETs MOSFT P-Ch -4.3A 50mOhm 10nC Log Lvl; Manufacturer_Name: Infineon; Datasheet Link: https://www.infineon.com/dgdl/irlml6401pbf.pdf?fileId=5546d462533600a401535668b96d2634; Height: 1.12mm; Manufacturer_Part_Number: IRLML6401TRPBF; Mouser Part Number: 942-IRLML6401TRPBF; Mouser Price/Stock: https://www.mouser.co.uk/ProductDetail/Infineon-Technologies/IRLML6401TRPBF?qs=9%252BKlkBgLFf1wviSVMCNr8A%3D%3D; Arrow Part Number: IRLML6401TRPBF; Arrow Price/Stock: https://www.arrow.com/en/products/irlml6401trpbf/infineon-technologies-ag?utm_currency=USD&region=europe
R7 R9 = RES 10M 0402 1% 100PPM: PPM: 100; Manufacturer: *; Manufacturers Part Number: *; Tolerance: 1%; Size: 0402; Supplier 1: Mouser; Supplier 2: Digi-Key; Supplier Part Number 1: 603-RC0402FR-0710ML; Supplier Part Number 2: 311-10.0MLRCT-ND
R8 = CL05A106MP5NUNC: Multilayer Ceramic Capacitors MLCC - SMD/SMT 10uF+/-20% 10V X5R 1005; Manufacturer_Name: SAMSUNG; Description: 0402 CAP CER 10UF 10V X5R; Datasheet Link: http://media.digikey.com/pdf/Data%20Sheets/Samsung%20PDFs/CL_Series_MLCC_ds.pdf; Height: 0.55mm; Manufacturer_Part_Number: CL05A106MP5NUNC; Mouser Part Number: 187-CL05A106MP5NUNC; Mouser Price/Stock: https://www.mouser.co.uk/ProductDetail/Samsung-Electro-Mechanics/CL05A106MP5NUNC?qs=X6jEic%2FHinA5hRYAnV6SHQ%3D%3D; Arrow Part Number: CL05A106MP5NUNC; Arrow Price/Stock: https://www.arrow.com/en/products/cl05a106mp5nunc/samsung-electro-mechanics?utm_currency=USD&region=europe
R10 = ERJ-U02F1002X: Thick Film Resistors - SMD 0402 1% 10Kohm Anti-Sulfur AEC-Q200; Manufacturer_Name: Panasonic; Datasheet Link: https://industrial.panasonic.com/cdbs/www-data/pdf/RDP0000/AOA0000C334.pdf; Height: 0.4mm; Manufacturer_Part_Number: ERJ-U02F1002X; Mouser Part Number: 667-ERJ-U02F1002X; Mouser Price/Stock: https://www.mouser.co.uk/ProductDetail/Panasonic/ERJ-U02F1002X?qs=bKFmlxG1yYBnPvi8EiFM4A%3D%3D; Arrow Part Number: ERJ-U02F1002X; Arrow Price/Stock: https://www.arrow.com/en/products/erj-u02f1002x/panasonic
R11 = CRCW0201383RFNED: Thick Film Resistors - SMD 383ohm 1% 200ppm; Manufacturer: Vishay; Supplier: Digikey; Supplier Part Number: 541-CRCW0201383RFNEDCT-ND; Manufacturer Part Number: CRCW0201383RFNED; RoHS: Yes; Category: Chip SMD Resistors; Stock: 17699; Pricing: 1=0,1, 10=0,041, 100=0,0209, 1000=0,01231, 2500=0,01038, 5000=0,00928 (USD); ComponentLink1URL: https://datasheet.ciiva.com/5860/1697337-5860072.pdf?src-supplier=Farnell; ComponentLink1Description: https://datasheet.ciiva.com/5860/1697337-5860072.pdf?src-supplier=Farnell; ComponentLink2URL: https://datasheet.ciiva.com/22683/1700795-22683160.pdf?src-supplier=Element14; ComponentLink2Description: https://datasheet.ciiva.com/22683/1700795-22683160.pdf?src-supplier=Element14
R12 = CRCW020127K4FNED: Resistor; Manufacturer_Name: Vishay; Datasheet Link: http://www.vishay.com/docs/20035/dcrcwe3.pdf; Height: 0.28mm; Manufacturer_Part_Number: CRCW020127K4FNED; Arrow Part Number: CRCW020127K4FNED; Arrow Price/Stock: https://www.arrow.com/en/products/crcw020127k4fned/vishay
R13 = RC0402JR-7D1KL: Thick Film Resistors - SMD 1 kOhms 62.5 mW 0402 5%; Manufacturer: Yageo; Supplier: Mouser; Supplier Part Number: 603-RC0402JR-7D1KL; Manufacturer Part Number: RC0402JR-7D1KL; RoHS: Yes; Category: Resistors; Stock: 654509; Pricing: 1=0,1, 10=0,008, 50=0,008, 100=0,006, 1000=0,004, 10000=0,001 (USD); Case/Package: 0402; Tolerance: 5%; RoHS Compliant: Yes
R14 = RC0402JR-7D330RL: Thick Film Resistors - SMD 330 Ohms 62.5mW 0402 5%; Manufacturer_Name: KEMET; Datasheet Link: http://www.yageo.com/documents/recent/PYu-RC0402_51_RoHS_L_6_r.pdf; Height: 0.4mm; Manufacturer_Part_Number: RC0402JR-7D330RL; Mouser Part Number: 603-RC0402JR-7D330RL; Mouser Price/Stock: https://www.mouser.co.uk/ProductDetail/YAGEO/RC0402JR-7D330RL?qs=F5EMLAvA7IAWTmBu9ZK%2FAQ%3D%3D; Arrow Part Number: RC0402JR-7D330RL; Arrow Price/Stock: https://www.arrow.com/en/products/rc0402jr-7d330rl/yageo
R15 = CRCW04021K60JNED: Thick Film Resistors - SMD 1/16watt 1.6Kohms 5%; Manufacturer_Name: Vishay; Datasheet Link: http://www.vishay.com/docs/20035/dcrcwe3.pdf; Height: 0.4mm; Manufacturer_Part_Number: CRCW04021K60JNED; Mouser Part Number: 71-CRCW0402J-1.6K-E3; Mouser Price/Stock: https://www.mouser.co.uk/ProductDetail/Vishay-Dale/CRCW04021K60JNED?qs=YX%252BK5oaHNYoma9PjuMNZCA%3D%3D
R37 = CRCW040249K9FKED: Thick Film Resistors - SMD 1/16watt 49.9Kohms 1%; Manufacturer_Name: Vishay; Datasheet Link: http://www.vishay.com/docs/20035/dcrcwe3.pdf; Height: 0.4mm; Manufacturer_Part_Number: CRCW040249K9FKED; Mouser Part Number: 71-CRCW0402-49.9K-E3; Mouser Price/Stock: https://www.mouser.co.uk/ProductDetail/Vishay-Dale/CRCW040249K9FKED?qs=hAuyw6LW%252BLhwjtjsHx%2FGDQ%3D%3D; Arrow Part Number: CRCW040249K9FKED; Arrow Price/Stock: https://www.arrow.com/en/products/crcw040249k9fked/vishay?region=nac
R38 R39 R41 = CRCW04020000Z0EEHP: Thick Film Resistors - SMD CRCW 402 jumper; Manufacturer_Name: Vishay; Datasheet Link: http://www.vishay.com/docs/20035/dcrcwe3.pdf; Height: 0.4mm; Manufacturer_Part_Number: CRCW04020000Z0EEHP; Mouser Part Number: 71-CRCW04020000Z0EEH; Mouser Price/Stock: https://www.mouser.co.uk/ProductDetail/Vishay-Dale/CRCW04020000Z0EEHP?qs=Imq1NPwxi74NTc567q7flQ%3D%3D; Arrow Part Number: CRCW04020000Z0EEHP; Arrow Price/Stock: https://www.arrow.com/en/products/crcw04020000z0eehp/vishay?utm_currency=USD&region=nac
R44 = RC0201FR-0710ML: Thick Film Resistors - SMD 10 MOhms 50mW 0201 1%; Manufacturer_Name: KEMET; Datasheet Link: http://www.yageo.com/documents/recent/PYu-RC0201_51_RoHS_L_8.pdf; Height: 0.26mm; Manufacturer_Part_Number: RC0201FR-0710ML; Mouser Part Number: 603-RC0201FR-0710ML; Mouser Price/Stock: https://www.mouser.com/Search/Refine.aspx?Keyword=603-RC0201FR-0710ML; Arrow Part Number: RC0201FR-0710ML; Arrow Price/Stock: https://www.arrow.com/en/products/rc0201fr-0710ml/yageo
SW1 = CT8132BV-IS3: Board Mount Hall Effect/Magnetic Sensors Integrated Digital Omnipolar, TMR, High Sensitivity Magnetic Switch, SOT23 Package, Ind Temp, 2Hz; Manufacturer_Name: Allegro MicroSystems; Datasheet Link: https://www.mouser.fr/datasheet/2/1115/Allegro_DS_CT813x_Datasheet_GS_FINAL_R2_v2-3441103.pdf; Height: 1.4mm; Manufacturer_Part_Number: CT8132BV-IS3; Mouser Part Number: 462-CT8132BV-IS3; Mouser Price/Stock: https://www.mouser.fr/ProductDetail/Allegro-MicroSystems/CT8132BV-IS3?qs=GBLSl2Akirsc7cUAudCqXg%3D%3D
U1 = BQ25176MDSGR: Battery Management 800-mA linear batter y charger for one-ce; Manufacturer_Name: Texas Instruments; Datasheet Link: https://www.ti.com/lit/gpn/bq25176m; Height: 0.8mm; Manufacturer_Part_Number: BQ25176MDSGR; Mouser Part Number: 595-BQ25176MDSGR; Mouser Price/Stock: https://www.mouser.co.uk/ProductDetail/Texas-Instruments/BQ25176MDSGR?qs=Y0Uzf4wQF3nVhcdITj52nA%3D%3D; Arrow Part Number: BQ25176MDSGR; Arrow Price/Stock: https://www.arrow.com/en/products/bq25176mdsgr/texas-instruments?region=nac

## Sheet satellite.SchDoc
size A4; Organization: Arribada Initiative; Address1: https://github.com/arribada; Address2: contact@arribada.org; Address3: arribada.org; Address4: UK - Portsmouth; DocumentNumber: 11; SheetNumber: 11; SheetTotal: 13
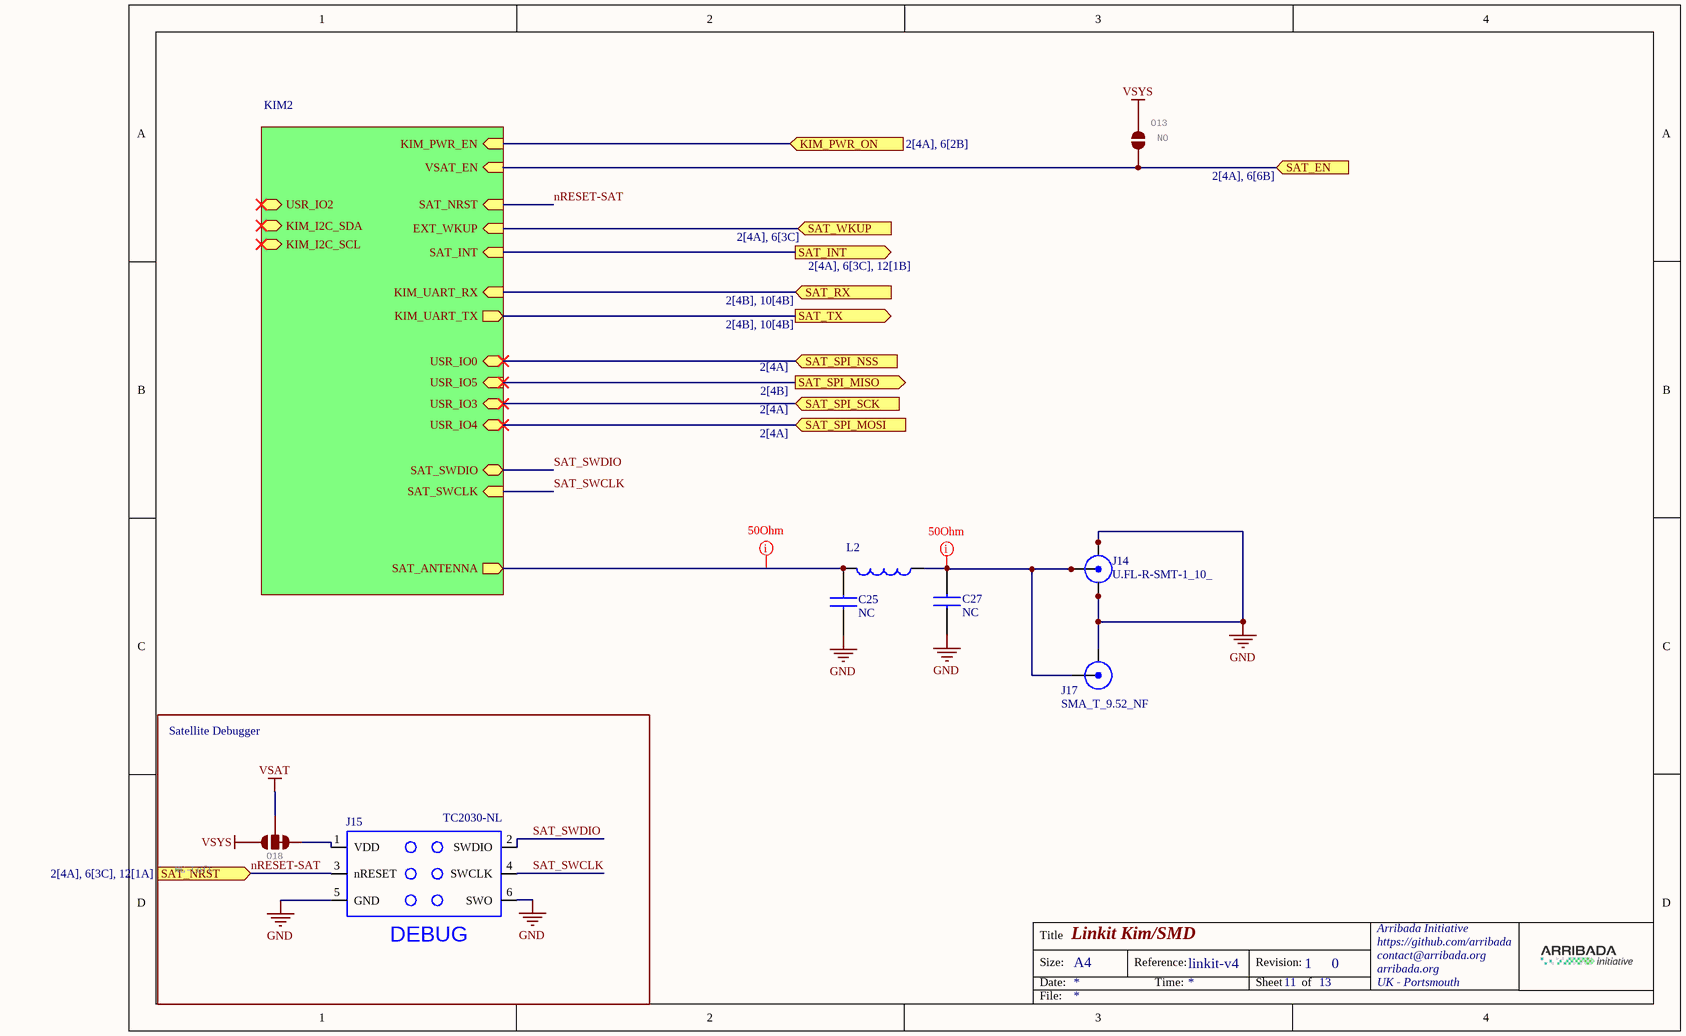
[diagram p6: satellite.SchDoc]

### Parts
C25  NC  [CAPC1005X55N]
C27  NC  [CAPC1005X55N]
J14  U.FL-R-SMT-1_10_  [U.FL-R-SMT-1(10)]
J15  TC2030-NL  [TC2030NL]
J17  SMA_T_9.52_NF  [CO_SAMTEC_SMA-J-P-ST-EMI]
L2  (no value)  [LQW18AN10NG80D]
O13  NO  [SMT-JUMPER_2_NO_TRACE_SILK]  (net tie, no BOM)
O18  NC-Left  [SMT-JUMPER_3_2-NCLEFT_TRACE_SILK]  (net tie, no BOM)

### Blocks framed on the sheet
Satellite Debugger: J15 O18

### Sub-sheets
KIM2 = sat-kim2.SchDoc: KIM_UART_TX (out), KIM_UART_RX (in), KIM_I2C_SDA (bidir), KIM_I2C_SCL (bidir), VSAT_EN (in), EXT_WKUP (in), SAT_INT (in), USR_IO0 (bidir), USR_IO2 (bidir), USR_IO3 (bidir), USR_IO4 (bidir), USR_IO5 (in), SAT_NRST (in), SAT_SWDIO (bidir), SAT_SWCLK (in), SAT_ANTENNA (out), KIM_PWR_EN (in)

### Ports
KIM_PWR_ON (in, see 2[4A], 6[2B]), SAT_EN (in, see 2[4A], 6[6B]), SAT_INT (out, see 2[4A], 6[3C], 12[1B]), SAT_NRST (in, see 2[4A], 6[3C], 12[1A]), SAT_RX (in, see 2[4B], 10[4B]), SAT_SPI_MISO (out, see 2[4B]), SAT_SPI_MOSI (in, see 2[4A]), SAT_SPI_NSS (in, see 2[4A]), SAT_SPI_SCK (in, see 2[4A]), SAT_TX (out, see 2[4B], 10[4B]), SAT_WKUP (in, see 2[4A], 6[3C])

### Nets
GND: C25.1 C27.1 J14.1(Y) J14.2(Y) J15.5(GND) J15.6(SWO) J17.2(Y)
VSAT: O18.2
VSYS: O13.1 O18.3
KIM_PWR_ON: port KIM_PWR_ON, sheet KIM2/KIM_PWR_EN
nRESET-SAT: J15.3(nRESET) ; port SAT_NRST, sheet KIM2/SAT_NRST
SAT_EN: O13.2 ; port SAT_EN, sheet KIM2/VSAT_EN
SAT_INT: port SAT_INT, sheet KIM2/SAT_INT
SAT_RX: port SAT_RX, sheet KIM2/KIM_UART_RX
SAT_SPI_MISO: port SAT_SPI_MISO, sheet KIM2/USR_IO5
SAT_SPI_MOSI: port SAT_SPI_MOSI, sheet KIM2/USR_IO4
SAT_SPI_NSS: port SAT_SPI_NSS, sheet KIM2/USR_IO0
SAT_SPI_SCK: port SAT_SPI_SCK, sheet KIM2/USR_IO3
SAT_SWCLK: J15.4(SWCLK) ; sheet KIM2/SAT_SWCLK
SAT_SWDIO: J15.2(SWDIO) ; sheet KIM2/SAT_SWDIO
SAT_TX: port SAT_TX, sheet KIM2/KIM_UART_TX
SAT_WKUP: port SAT_WKUP, sheet KIM2/EXT_WKUP
NetC25_2: C25.2 L2.2 ; sheet KIM2/SAT_ANTENNA
NetC27_2: C27.2 J14.3(X) J17.1(X) L2.1
NetJ15_1: J15.1(VDD) O18.1

### Layout directives
rule Impedance Constraint [Min = 48.00    Max = 52.00    ]; net class 50R_Net: NetC25_2, NetC27_2

### Notes on the sheet
- Title
- Size:
- Date:
- A4
- Reference:
- Time:
- Revision:
- Sheet
- of
- File:
- (in symbol TC2030-NL) DEBUG

### Library data of the parts
C25 C27 = GEN_CAP_0402: Generic capacitor; ComponentLink1Description: Mouser; ComponentLink1URL: https://www.mouser.fr/ProductDetail/Murata-Electronics/GCM1555C1H4R7CA16D?qs=jDWTHf1mkXZYnVNtgyfFgw%3D%3D
J14 = U.FL-R-SMT-1_10_: UFL SMT PCB receptable,DC-6GHz Hirose Straight 50 Surface Mount UFL Connector, Receptacle, Solder Termination Coaxial; Description 1: Rf Connectors / Coaxial Connectors SMT Ml Rec Au 50 Ohm W/anti Sldr Wckng Rl; Category 1: RF / Coaxial Connectors; Body Material: Bronze; Body Plating: Silver; Dielectric Material: Polymer; Center Contact Plating: Gold; Impedance: 50R; Connector Type: Receptacle,Male Pin; Max Frequency: 6GHz; Number of Ports: 1; Mating Cycles: 30; Insulation Resistance: 500MR; Mouser Part Number: 798-U.FL-R-SMT-110; Mouser Price/Stock: https://www.mouser.co.uk/ProductDetail/Hirose-Connector/U.FL-R-SMT-110?qs=kL1ClTr6oBoOdtqlGQpQrQ%3D%3D; Manufacturer_Name: Hirose; Manufacturer_Part_Number: U.FL-R-SMT-1(10); Datasheet Link: https://www.hirose.com/product/document?clcode=CL0331-0472-2-10&productname=U.FL-R-SMT-1(10)&series=U.FL&documenttype=2DDrawing&lang=en&documentid=0000940684; Supplier 1: Mouser; Supplier Part Number 1: 798-U.FL-R-SMT-110; Manufacturer 1: Hirose; Manufacturer Part Number 1: U.FL-R-SMT-1(10); RoHS 1: Yes; Stock 1: 504085; Pricing 1: 1=1,44, 10=1,26, 50=1,26, 100=1,12, 1000=0,803, 10000=0,803 (USD); Mount: Surface Mount; Contact Material: Brass; Housing Color: Beige; Weight: 0.001764oz; Min Operating Temperature: -40°C; Max Operating Temperature: 90°C; Packaging: Tape and Reel; Package Quantity: 2500; Fastening Type: SNAP-ON; Termination: Solder; Series: U.FL; Orientation: Straight; Lead Free: Lead Free; RoHS Compliant: Yes; ComponentLink1URL: https://datasheet.ciiva.com/11762/0900766b8105243f-11762474.pdf?src-supplier=Rs; ComponentLink1Description: https://datasheet.ciiva.com/11762/0900766b8105243f-11762474.pdf?src-supplier=Rs; ComponentLink2URL: https://datasheet.ciiva.com/7651/91524-7651915.pdf?src-supplier=Element14; ComponentLink2Description: https://datasheet.ciiva.com/7651/91524-7651915.pdf?src-supplier=Element14; ComponentLink3URL: https://datasheet.ciiva.com/7651/91524-7651914.pdf?src-supplier=Element14; ComponentLink3Description: https://datasheet.ciiva.com/7651/91524-7651914.pdf?src-supplier=Element14
J15 = TC2030-NL: CON PLUG OF NAILS 6 PIN FOOTPRINT NO LEGS; Manufacturer: Tag-Connect; Manufacturers Part Number: NOT FITTED PART; Supplier Part Number 1: NOT FITTED PART; Supplier Part Number 2: NOT FITTED PART; Distributor 1: EBV; Distributor 2: Future Electronics
J17 = SMA_T_9.52_NF: SMA End Launch Jack 1.0 mm Board, 50 ohm; Manufacturer: COAX CONNECTORS LTD; Manufacturer_Part_Number: 30-462-D3-1.1mm
L2 = LQW18AN18NG8ZD: Inductor Wirewound , 18 nH, 75 Milliohm, ± 2%, 1.4 A, 0603 [1608 Metric]; Value: 18nH; Supplier 1: Mouser; Supplier Part Number 1: 81-LQW18AN18NG8ZD
O13 = JUMPER-SMT_2_NO_TRACE_SILK_1: Normally opened trace jumper / This jumper has no trace between two pads so it's normally closed (NO).; GateName_1: G$1; SymbolName_1: SMT-JUMPER_2_NC_TRACE; DeviceName: _SILK; DeviceSetName: JUMPER-SMT_2_NC_TRACE; LibraryName: SparkFun-Jumpers
O18 = JUMPER-SMT_3_2-NCLEFT_TRACE_SILK: Normally opened lefttrace jumper (1 of 2 connections)    This jumper has a trace between left pad pads so they are normally closed (NC). Use a razor knife to open the connection(s). For best results follow the IPC guidelines for cutting traces: Cutout at least 0.063 mm (0.005 in).  Remove all loose material to clean up the cut area.  Seal the cut with an approved epoxy.       Reapply solder to reclose the connection(s).; GateName_1: G$1; SymbolName_1: SMT-JUMPER_3_2-NC_TRACE; DeviceName: _SILK; DeviceSetName: JUMPER-SMT_3_2-NC_TRACE; LibraryName: SparkFun-Jumpers

## Sheet sat-kim2.SchDoc
size A4; Organization: Arribada Initiative; Address1: https://github.com/arribada; Address2: contact@arribada.org; Address3: arribada.org; Address4: UK - Portsmouth; DocumentNumber: 12; SheetNumber: 12; SheetTotal: 13
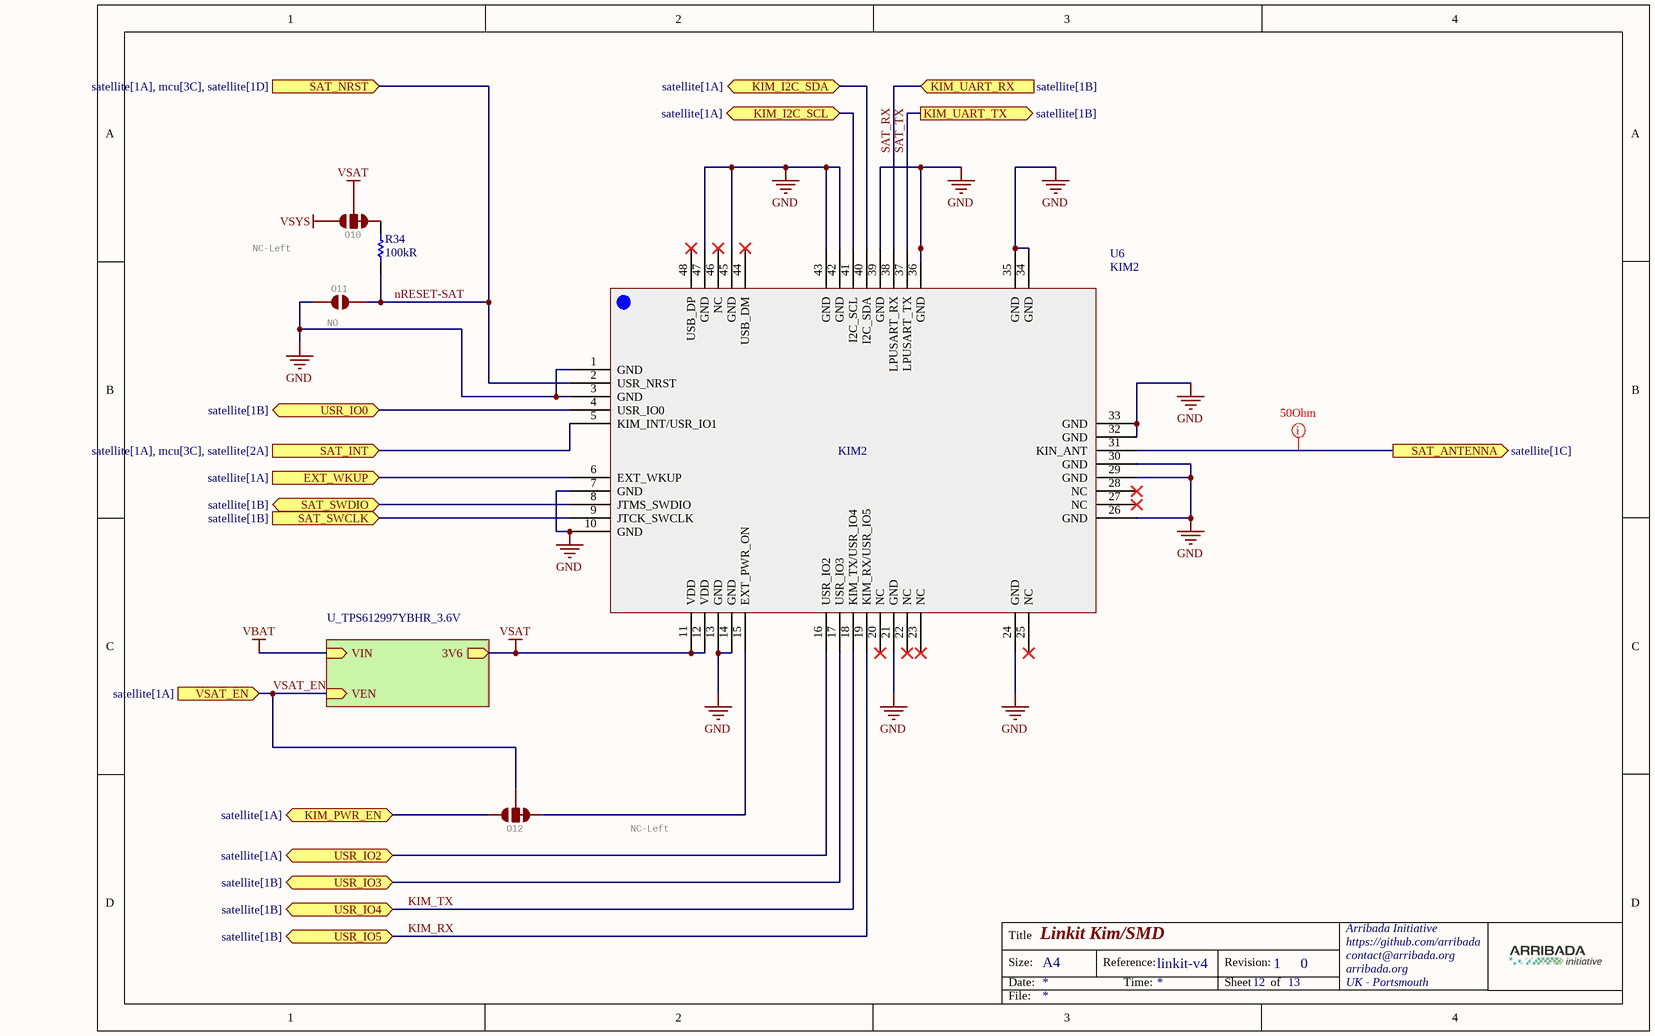
[diagram p7: sat-kim2.SchDoc]

### Parts
O10  NC-Left  [SMT-JUMPER_3_2-NCLEFT_TRACE_SILK]  (net tie, no BOM)
O11  NO  [SMT-JUMPER_2_NO_TRACE_SILK]  (net tie, no BOM)
O12  NC-Left  [SMT-JUMPER_3_2-NCLEFT_TRACE_SILK]  (net tie, no BOM)
R34  value 100kR  [RESC0603X28N]  (hidden comment: CRCW0201100KJNED)
U6  KIM2  [KIM2 FOOTPRINT]

### Sub-sheets
U_TPS612997YBHR_3.6V = TPS612997YBHR_3.6V_lowIQ_1.9A (file not in this document): VIN (in), VEN (in), 3V6 (out)

### Ports
EXT_WKUP (in, see satellite[1A]), KIM_I2C_SCL (bidir, see satellite[1A]), KIM_I2C_SDA (bidir, see satellite[1A]), KIM_PWR_EN (bidir, see satellite[1A]), KIM_UART_RX (in, see satellite[1B]), KIM_UART_TX (out, see satellite[1B]), SAT_ANTENNA (out, see satellite[1C]), SAT_INT (in, see satellite[1A], mcu[3C], satellite[2A]), SAT_NRST (in, see satellite[1A], mcu[3C], satellite[1D]), SAT_SWCLK (in, see satellite[1B]), SAT_SWDIO (bidir, see satellite[1B]), USR_IO0 (bidir, see satellite[1B]), USR_IO2 (bidir, see satellite[1A]), USR_IO3 (bidir, see satellite[1B]), USR_IO4 (bidir, see satellite[1B]), USR_IO5 (bidir, see satellite[1B]), VSAT_EN (in, see satellite[1A])

### Nets
GND: O11.1 U6.1(GND) U6.3(GND) U6.7(GND) U6.10(GND) U6.13(GND) U6.14(GND) U6.21(GND) U6.24(GND) U6.26(GND) U6.29(GND) U6.30(GND) U6.32(GND) U6.33(GND) U6.34(GND) U6.35(GND) U6.36(GND) U6.39(GND) U6.42(GND) U6.43(GND) U6.45(GND) U6.47(GND)
VSAT: O10.2 U6.11(VDD) U6.12(VDD) ; sheet U_TPS612997YBHR_3.6V/3V6
VSYS: O10.3
EXT_WKUP: U6.6(EXT_WKUP) ; port EXT_WKUP
KIM_I2C_SCL: U6.41(I2C_SCL) ; port KIM_I2C_SCL
KIM_I2C_SDA: U6.40(I2C_SDA) ; port KIM_I2C_SDA
KIM_PWR_EN: O12.3 ; port KIM_PWR_EN
KIM_RX: U6.19(KIM_RX/USR_IO5) ; port USR_IO5
KIM_TX: U6.18(KIM_TX/USR_IO4) ; port USR_IO4
nRESET-SAT: O11.2 R34.1 U6.2(USR_NRST) ; port SAT_NRST
SAT_ANTENNA: U6.31(KIN_ANT) ; port SAT_ANTENNA
SAT_INT: U6.5(KIM_INT/USR_IO1) ; port SAT_INT
SAT_RX: U6.38(LPUSART_RX) ; port KIM_UART_RX
SAT_SWCLK: U6.9(JTCK_SWCLK) ; port SAT_SWCLK
SAT_SWDIO: U6.8(JTMS_SWDIO) ; port SAT_SWDIO
SAT_TX: U6.37(LPUSART_TX) ; port KIM_UART_TX
USR_IO0: U6.4(USR_IO0) ; port USR_IO0
USR_IO2: U6.16(USR_IO2) ; port USR_IO2
USR_IO3: U6.17(USR_IO3) ; port USR_IO3
VSAT_EN: O12.2 ; port VSAT_EN, sheet U_TPS612997YBHR_3.6V/VEN
NetO10_1: O10.1 R34.2
NetO12_1: O12.1 U6.15(EXT_PWR_ON)

Not connected (* = marked no-connect by the designer): U6 20(NC)* 22(NC)* 23(NC)* 25(NC)* 27(NC)* 28(NC)* 44(USB_DM)* 46(NC)* 48(USB_DP)*

### Layout directives
rule Impedance Constraint [Min = 48.00    Max = 52.00    ]; net class 50R_Net: SAT_ANTENNA

### Notes on the sheet
- Title
- Size:
- Date:
- A4
- Reference:
- Time:
- Revision:
- Sheet
- of
- File:

### Library data of the parts
O10 O12 = JUMPER-SMT_3_2-NCLEFT_TRACE_SILK: as O18 on sheet satellite; LibraryName: SparkFun-Jumpers
O11 = JUMPER-SMT_2_NO_TRACE_SILK_1: as O13 on sheet satellite; LibraryName: SparkFun-Jumpers
R34 = CRCW0201100KJNED: Thick Film Resistors - SMD 1/20watt 100Kohms 5% 200ppm; Manufacturer_Name: Vishay; Datasheet Link: http://www.vishay.com/docs/20035/dcrcwe3.pdf; Height: 0.28mm; Manufacturer_Part_Number: CRCW0201100KJNED; Mouser Part Number: 71-CRCW0201100KJNED; Mouser Price/Stock: https://www.mouser.co.uk/ProductDetail/Vishay-Dale/CRCW0201100KJNED?qs=IQLUlsvFoXu8A8gHIw6owA%3D%3D; Arrow Part Number: CRCW0201100KJNED; Arrow Price/Stock: https://www.arrow.com/en/products/crcw0201100kjned/vishay
U6 = KIM2: KIM2 Module 48 pins 1.27mm pitch 36.6 x 25.4 x 5mm; Manufacturer: Kineis; Tolerance: -30 /  +55°C; Rating: 3.3-5V; BOI: SMD48 36.6x25.4x5mm; DESIG: KIMFLEX Module 48 pins 1.27mm pitch 36.6 x 25.4 x 5mm; VAL: KIM2; K P/N: -; Manufacturer P/N: KIM2; Supplier: Kineis; Supplier P/N: KIMFLEX

## Nets that join several sheets
GND: linkit-v4 (O14.1 Q1.2 R6.2), mcu (29 pins), sensors (13 pins), interface (34 pins), pwr (10 pins), satellite (7 pins), sat-kim2 (22 pins)
VBAT: linkit-v4 (Q2.2 R4.1), interface (6 pins), pwr (6 pins)
VBUS: mcu (U2.12), interface (5 pins), pwr (R38.2)
VSAT: satellite (O18.2), sat-kim2 (O10.2 U6.11 U6.12)
VSYS: linkit-v4 (R1.2 R2.2 R48.2 R49.1), mcu (5 pins), sensors (C10.2 C12.2 U4.1 U4.8), interface (J9.1 J11.1 J12.2), satellite (O13.1 O18.3), sat-kim2 (O10.3)
ADC2: sensors (R33.1), interface (J9.5)
ADC3: sensors (R32.1), interface (J9.12)
ADC_ALERT_RDY: mcu (U2.64), sensors (R28.2 U5.2)
EXT_SCL: mcu (U2.39), interface (J11.2 J12.4)
EXT_SDA: mcu (U2.37), interface (J11.3 J12.3)
GPS_PWR_EN: mcu (R21.2 U2.50), sensors (U4.7)
IMU_PWR: mcu (R18.2 U2.41), sensors (R31.1)
nRESET-SAT: mcu (U2.42), satellite (J15.3), sat-kim2 (O11.2 R34.1 U6.2)
NRF_DBG: mcu (J2.6 U2.43), interface (J1.2)
SAT_EN: mcu (R20.2 U2.51), satellite (O13.2)
SAT_INT: mcu (U2.46), sat-kim2 (U6.5)
SPV+: interface (J6.1), pwr (C2.1 D4.2)
SPV-: interface (J6.2), pwr (C2.2 FB2.1)
USB_D_N: mcu (U2.10), interface (U7.6)
USB_D_P: mcu (U2.8), interface (U7.4)
VADC_EN: mcu (R43.2 U2.3), sensors (U4.2)

## Assembly variants
linkit-v4-hw-kim: not fitted BT1 C47 C49 C50 J1 J2 J7 J10 J12 J13 J14 J15 MEC1 MH1 MH2 MH3 MH4 R1 R2 R19 R26 R29 R35 R43 R44 R52; alternate parts L3 -> LQW18AN10NG80D, R8 -> CL05A106MP5NUNC
linkit-v4-hw-SMD: not fitted BT1 C47 C49 C50 J1 J2 J7 J10 J12 J13 J14 J15 L3 MEC1 MH1 MH2 MH3 MH4 R1 R2 R18 R19 R20 R21 R22 R26 R29 R35 R43 R44 R52 R57
Variant of linkit-v4-hw: all parts fitted